# Altium schematic sheet A3H1_OWN.SchDoc: Х
size 209 x 297 mm; ApprovedBy: Х; CheckedBy: Х; Author: Х; CompanyName: Х; DrawnBy: Х; Engineer: Х; Organization: Х; Address1: Х; Address2: Х; Address3: Х; Address4: Х; DocumentNumber: Х; Revision: Х; SheetNumber: Х; SheetTotal: Х; 1_Обозначение_документа: АБВГ.ХХХХХХ.ХХХ; 2_Наименование_изделия: Изделие; 3_Наименование_документа_1: Схема электрическая; 4_Наименование_документа_2: принципиальная; 5_Разраб.: Саченков В.; 11_Организация: АО "Завод ПРОТОН"; 14_Масштаб: 1:1; 15_Лист: 2; 16_Листов: 1; ImagePath: Х; Application_BuildNumber: Х
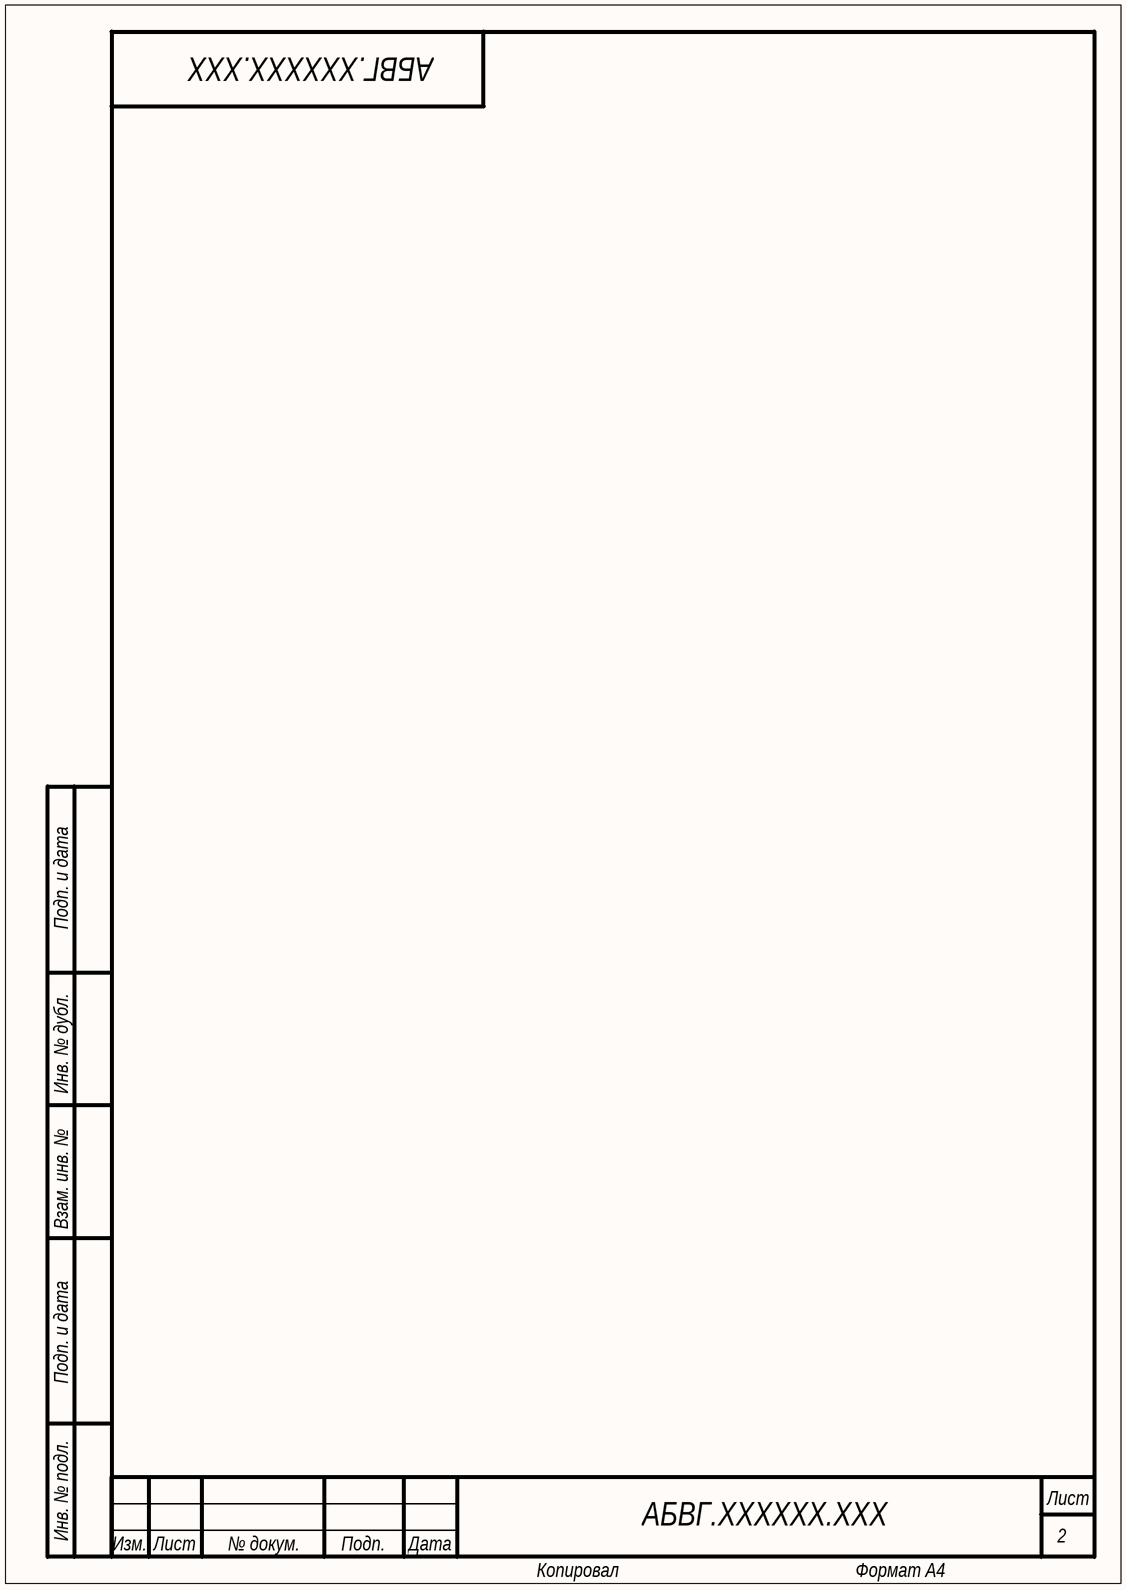
[diagram p0: A3H1_OWN.SchDoc]

## Notes on the sheet
- Подп. и дата
- Инв. № дубл.
- Взам. инв. №
- Инв. № подл.
- Изм.
- Лист
- № докум.
- Подп.
- Дата
- Копировал
- Формат А4